# Altium schematic sheet 7 ddr3 memory.SchDoc
size A4; SheetNumber: 10; SheetTotal: 13
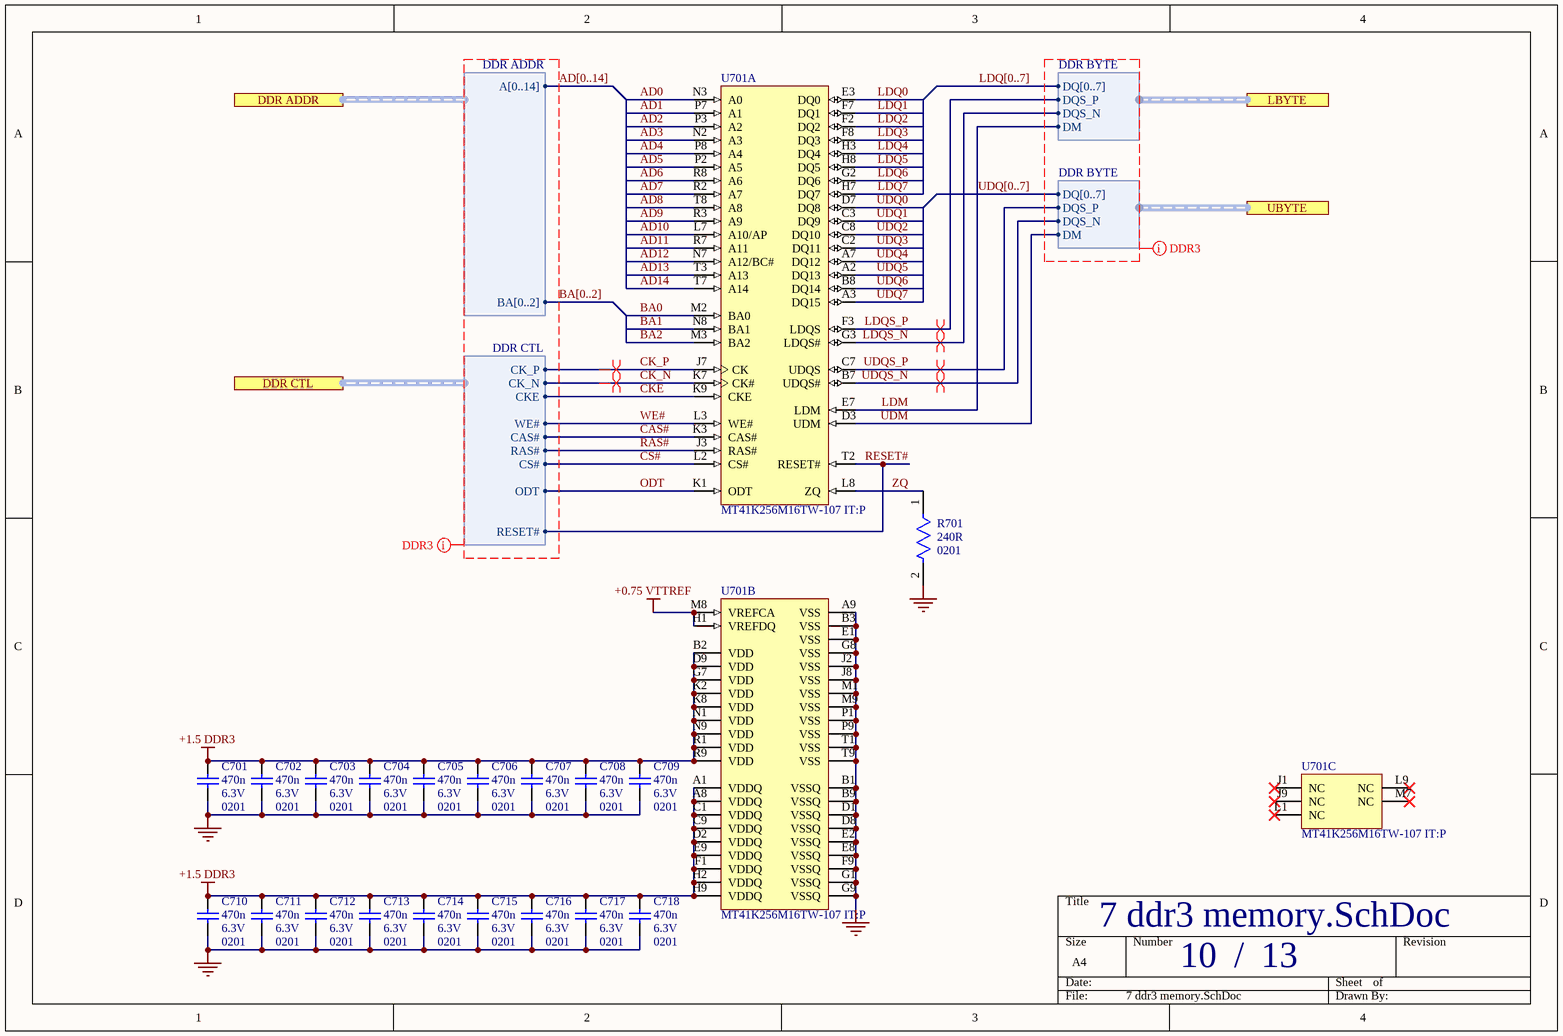
[diagram p0: 7 ddr3 memory.SchDoc]

## Parts
C701  value 470n  Voltage Rating: 6.3V  Package: 0201  [CAPC0603X33X15LL03T05]  (hidden comment: 02016D474KAT2A)
C702  value 470n  Voltage Rating: 6.3V  Package: 0201  [CAPC0603X33X15LL03T05]  (hidden comment: 02016D474KAT2A)
C703  value 470n  Voltage Rating: 6.3V  Package: 0201  [CAPC0603X33X15LL03T05]  (hidden comment: 02016D474KAT2A)
C704  value 470n  Voltage Rating: 6.3V  Package: 0201  [CAPC0603X33X15LL03T05]  (hidden comment: 02016D474KAT2A)
C705  value 470n  Voltage Rating: 6.3V  Package: 0201  [CAPC0603X33X15LL03T05]  (hidden comment: 02016D474KAT2A)
C706  value 470n  Voltage Rating: 6.3V  Package: 0201  [CAPC0603X33X15LL03T05]  (hidden comment: 02016D474KAT2A)
C707  value 470n  Voltage Rating: 6.3V  Package: 0201  [CAPC0603X33X15LL03T05]  (hidden comment: 02016D474KAT2A)
C708  value 470n  Voltage Rating: 6.3V  Package: 0201  [CAPC0603X33X15LL03T05]  (hidden comment: 02016D474KAT2A)
C709  value 470n  Voltage Rating: 6.3V  Package: 0201  [CAPC0603X33X15LL03T05]  (hidden comment: 02016D474KAT2A)
C710  value 470n  Voltage Rating: 6.3V  Package: 0201  [CAPC0603X33X15LL03T05]  (hidden comment: 02016D474KAT2A)
C711  value 470n  Voltage Rating: 6.3V  Package: 0201  [CAPC0603X33X15LL03T05]  (hidden comment: 02016D474KAT2A)
C712  value 470n  Voltage Rating: 6.3V  Package: 0201  [CAPC0603X33X15LL03T05]  (hidden comment: 02016D474KAT2A)
C713  value 470n  Voltage Rating: 6.3V  Package: 0201  [CAPC0603X33X15LL03T05]  (hidden comment: 02016D474KAT2A)
C714  value 470n  Voltage Rating: 6.3V  Package: 0201  [CAPC0603X33X15LL03T05]  (hidden comment: 02016D474KAT2A)
C715  value 470n  Voltage Rating: 6.3V  Package: 0201  [CAPC0603X33X15LL03T05]  (hidden comment: 02016D474KAT2A)
C716  value 470n  Voltage Rating: 6.3V  Package: 0201  [CAPC0603X33X15LL03T05]  (hidden comment: 02016D474KAT2A)
C717  value 470n  Voltage Rating: 6.3V  Package: 0201  [CAPC0603X33X15LL03T05]  (hidden comment: 02016D474KAT2A)
C718  value 470n  Voltage Rating: 6.3V  Package: 0201  [CAPC0603X33X15LL03T05]  (hidden comment: 02016D474KAT2A)
R701  Case/Package: 0201  Resistance: 240R  [FP-RMCF0201-IPC_C]  (hidden comment: RMCF0201FG240R)
U701  MT41K256M16TW-107 IT:P  [MICT-TW-96]  (parts A,B,C of 3)

## Ports
DDR ADDR (harness DDR ADDR), DDR CTL (harness DDR CTL), LBYTE (harness DDR BYTE), UBYTE (harness DDR BYTE)

## Harnesses
DDR ADDR: A[0..14], BA[0..2]
DDR CTL: CK_P, CK_N, CKE, WE#, CAS#, RAS#, CS#, ODT, RESET#
DDR BYTE: DQ[0..7], DQS_P, DQS_N, DM

## Nets
+0.75 VTTREF: U701.H1(VREFDQ) U701.M8(VREFCA)
+1.5 DDR3: C701.1 C702.1 C703.1 C704.1 C705.1 C706.1 C707.1 C708.1 C709.1 C710.1 C711.1 C712.1 C713.1 C714.1 C715.1 C716.1 C717.1 C718.1 U701.A1(VDDQ) U701.A8(VDDQ) U701.B2(VDD) U701.C1(VDDQ) U701.C9(VDDQ) U701.D2(VDDQ) U701.D9(VDD) U701.E9(VDDQ) U701.F1(VDDQ) U701.G7(VDD) U701.H2(VDDQ) U701.H9(VDDQ) U701.K2(VDD) U701.K8(VDD) U701.N1(VDD) U701.N9(VDD) U701.R1(VDD) U701.R9(VDD)
GND: C701.2 C702.2 C703.2 C704.2 C705.2 C706.2 C707.2 C708.2 C709.2 C710.2 C711.2 C712.2 C713.2 C714.2 C715.2 C716.2 C717.2 C718.2 R701.2 U701.A9(VSS) U701.B1(VSSQ) U701.B3(VSS) U701.B9(VSSQ) U701.D1(VSSQ) U701.D8(VSSQ) U701.E1(VSS) U701.E2(VSSQ) U701.E8(VSSQ) U701.F9(VSSQ) U701.G1(VSSQ) U701.G8(VSS) U701.G9(VSSQ) U701.J2(VSS) U701.J8(VSS) U701.M1(VSS) U701.M9(VSS) U701.P1(VSS) U701.P9(VSS) U701.T1(VSS) U701.T9(VSS)
AD0: U701.N3(A0)
AD1: U701.P7(A1)
AD2: U701.P3(A2)
AD3: U701.N2(A3)
AD4: U701.P8(A4)
AD5: U701.P2(A5)
AD6: U701.R8(A6)
AD7: U701.R2(A7)
AD8: U701.T8(A8)
AD9: U701.R3(A9)
AD10: U701.L7(A10/AP)
AD11: U701.R7(A11)
AD12: U701.N7(A12/BC#)
AD13: U701.T3(A13)
AD14: U701.T7(A14)
BA0: U701.M2(BA0)
BA1: U701.N8(BA1)
BA2: U701.M3(BA2)
CAS#: U701.K3(CAS#) ; port DDR CTL.CAS#
CK_N: U701.K7(CK#) ; port DDR CTL.CK_N
CK_P: U701.J7(CK) ; port DDR CTL.CK_P
CKE: U701.K9(CKE) ; port DDR CTL.CKE
CS#: U701.L2(CS#) ; port DDR CTL.CS#
LDM: U701.E7(LDM) ; port LBYTE.DM
LDQ0: U701.E3(DQ0)
LDQ1: U701.F7(DQ1)
LDQ2: U701.F2(DQ2)
LDQ3: U701.F8(DQ3)
LDQ4: U701.H3(DQ4)
LDQ5: U701.H8(DQ5)
LDQ6: U701.G2(DQ6)
LDQ7: U701.H7(DQ7)
LDQS_N: U701.G3(LDQS#) ; port LBYTE.DQS_N
LDQS_P: U701.F3(LDQS) ; port LBYTE.DQS_P
ODT: U701.K1(ODT) ; port DDR CTL.ODT
RAS#: U701.J3(RAS#) ; port DDR CTL.RAS#
RESET#: U701.T2(RESET#) ; port DDR CTL.RESET#
UDM: U701.D3(UDM) ; port UBYTE.DM
UDQ0: U701.D7(DQ8)
UDQ1: U701.C3(DQ9)
UDQ2: U701.C8(DQ10)
UDQ3: U701.C2(DQ11)
UDQ4: U701.A7(DQ12)
UDQ5: U701.A2(DQ13)
UDQ6: U701.B8(DQ14)
UDQ7: U701.A3(DQ15)
UDQS_N: U701.B7(UDQS#) ; port UBYTE.DQS_N
UDQS_P: U701.C7(UDQS) ; port UBYTE.DQS_P
WE#: U701.L3(WE#) ; port DDR CTL.WE#
ZQ: R701.1 U701.L8(ZQ)

Not connected (* = marked no-connect by the designer): U701 J1(NC)* J9(NC)* L1(NC)* L9(NC)* M7(NC)*

## Buses and harness runs
bus AD[0..14]
bus BA[0..2]
bus LDQ[0..7]
bus UDQ[0..7]

## Layout directives
differential pair: CK_N, CK_P, LDQS_N, LDQS_P, UDQS_N, UDQS_P
net class DDR3: (no net found under the mark), AD[0..14], BA[0..2]

## Notes on the sheet
- /

## Library data of the parts
C701-C718 = CMP-2010-00405-1: Manufacturer: AVX Interconnect / Elco; Part Number: 02016D474KAT2A
R701 = CMP-26527-006303-1: 240Ω ±1% 0.05W 0201 Thick Film Chip Resistor AEC-Q200 compliant; Temperature Coefficient: 200ppm/°C; Max Power Dissipation: 50mW; Tolerance: 1%; Resistor Type: Thick Film; Case Code (Imperial): 0201; Case Code (Metric): 0603; Min Operating Temperature: -55°C; Length: 0.024inch; Packaging: Tape and Reel; Max Operating Temperature: 125°C; Number of Terminations: 2; Width: 0.012inch; Height: 0.009inch
U701 = CMP-2000-06773-2: Automotive DDR3L SDRAM, 4 GB, 933 MHz, 1.283 to 1.45 V, -40 to 95 degC, 96-Pin TFBGA, RoHS, Tray; Manufacturer: Micron; Data Bus Width: 16b; Address Bus Width: 15b; Operating Supply Voltage: 1.35V; Access Time: 1.07ns; Max Frequency: 933MHz; Density: 4Gb; Package Reference: TW-96; Max Operating Temperature: 95degC; RoHSCompliant: true; Datasheet Version: Rev. D, 02/2017; Datasheet URL: https://www.micron.com/~/media/documents/products/data-sheet/dram/ddr3/4gb_automotive_ddr3l.pdf; Mount: SurfaceMount; Min Operating Temperature: -40degC; Package Description: 96-Ball Fine Pitch Ball Grid Array, Body 14 x 8 mm, Pitch 0.8 mm; Mounting Technology: SurfaceMount; Contact Plating: Silver; Manufacturer URL: http://www.micron.com/